# EAGLE design TOMO (EAGLE 6.4)
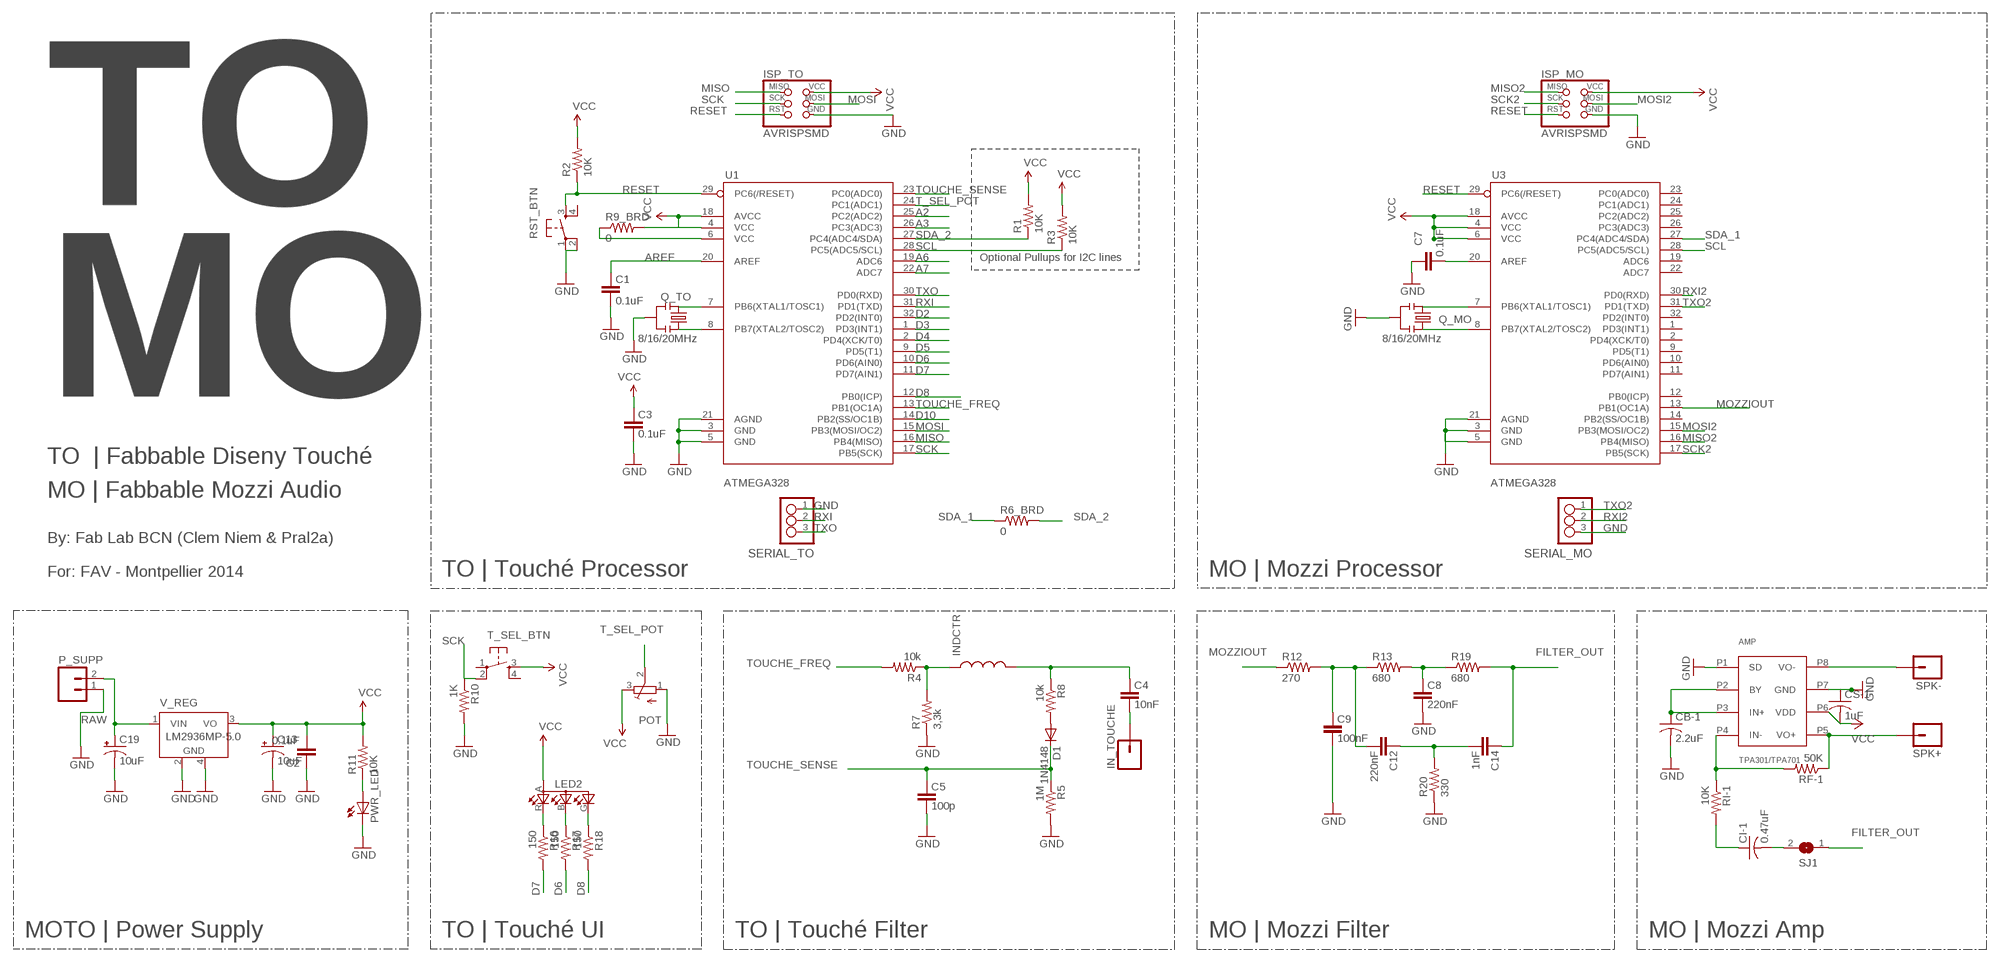
[diagram p0: schematic, sheet 1]

## Parts
AMP  TPA301/TPA701  [SOIC8]
C1  0.1uF  CAP1206  [1206]
C2  0.1uF  CAP1206  [1206]
C3  0.1uF  CAP1206  [1206]
C4  10nF  CAP1206  [1206]
C5  100p  CAP1206  [1206]
C7  0.1uF  CAP1206  [1206]
C8  220nF  CAP1206  [1206]
C9  100nF  CAP1206  [1206]
C12  220nF  CAP1206  [1206]
C13  10uF  CAP_POL1206  [EIA3216]
C14  1nF  CAP1206  [1206]
C19  10uF  CAP_POL1206  [EIA3216]
CB-1  2.2uF  C-USC1206  [C1206]
CI-1  0.47uF  C-USC1206  [C1206]
CS-1  1uF  C-USC1206  [C1206]
D1  1N4148  DIODESOD123  [SOD123]
IN_TOUCHE  M01PTH  [1X01]
INDCTR  INDUCTOR  [CDRH3D28]
ISP_MO  AVRISPSMD  [2X03SMD]
ISP_TO  AVRISPSMD  [2X03SMD]
LED2  LEDRGBOLD  [P-LCC-4-3]
P_SUPP  M02PTH  [1X02]
POT  TRIMPOTTC33X  [TC33X]
PWR_LED  LED1206  [1206]
Q_MO  8/16/20MHz  RESONATORSMD  [RESONATOR-SMD]
Q_TO  8/16/20MHz  RESONATORSMD  [RESONATOR-SMD]
R1  10K  RESISTOR1206  [1206]
R2  10K  RESISTOR1206  [1206]
R3  10K  RESISTOR1206  [1206]
R4  10k  RESISTOR1206  [1206]
R5  1M  RESISTOR1206  [1206]
R6_BRD  0  RESISTOR1206  [1206]
R7  3,3k  RESISTOR1206  [1206]
R8  10k  RESISTOR1206  [1206]
R9_BRD  0  RESISTOR1206  [1206]
R10  1K  RESISTOR1206  [1206]
R11  10K  RESISTOR1206  [1206]
R12  270  RESISTOR1206  [1206]
R13  680  RESISTOR1206  [1206]
R16  150  RESISTOR1206  [1206]
R17  150  RESISTOR1206  [1206]
R18  150  RESISTOR1206  [1206]
R19  680  RESISTOR1206  [1206]
R20  330  RESISTOR0603-RES  [0603-RES]
RF-1  50K  R-US_R1206  [R1206]
RI-1  10K  R-US_R1206  [R1206]
RST_BTN  6MM_SWITCH6MM_SWITCH  [6MM_SWITCH]
SERIAL_MO  3_PIN_HEADERHEADER  [SMT_PINS_3]
SERIAL_TO  3_PIN_HEADERHEADER  [SMT_PINS_3]
SJ1  SJW  [SJW]
SPK+  M01PTH  [1X01]
SPK-  M01PTH  [1X01]
T_SEL_BTN  6MM_SWITCH6MM_SWITCH  [6MM_SWITCH]
U1  ATMEGA328  ATMEGA168ATMEGA88THIN  [ATMEGA88THIN]
U3  ATMEGA328  ATMEGA168ATMEGA88THIN  [ATMEGA88THIN]
V_REG  LM2936MP-5.0  [SOT223]

## Nets
A2: U1.25(PC2(ADC2))
A3: U1.26(PC3(ADC3))
A6: U1.19(ADC6)
A7: U1.22(ADC7)
AREF: C1.2 U1.20(AREF)
D2: U1.32(PD2(INT0))
D3: U1.1(PD3(INT1))
D4: U1.2(PD4(XCK/T0))
D5: U1.9(PD5(T1))
D6: R17.2 U1.10(PD6(AIN0))
D7: R16.2 U1.11(PD7(AIN1))
D8: R18.2 U1.12(PB0(ICP))
D10: U1.14(PB2(SS/OC1B))
FILTER_OUT: C14.2 R19.2 SJ1.1
GND [gnd]: AMP.P1(SD) AMP.P7(GND) C1.1 C2.1 C3.1 C5.1 C7.2 C8.1 C9.1 C13.C(-) C19.C(-) CB-1.2 CS-1.1 ISP_MO.6(GND) ISP_TO.6(GND) P_SUPP.1 POT.1(A) PWR_LED.2(C) Q_MO.2 Q_TO.2 R5.2 R7.1 R10.2 R20.1 RST_BTN.1(P) RST_BTN.2(P1) SERIAL_MO.3 SERIAL_TO.1 U1.3(GND) U1.5(GND) U1.21(AGND) U3.3(GND) U3.5(GND) U3.21(AGND) V_REG.2(GND) V_REG.4(GND)
MISO: ISP_TO.1(MISO) U1.16(PB4(MISO))
MISO2: ISP_MO.1(MISO) U3.16(PB4(MISO))
MOSI: ISP_TO.4(MOSI) U1.15(PB3(MOSI/OC2))
MOSI2: ISP_MO.4(MOSI) U3.15(PB3(MOSI/OC2))
MOZZIOUT: R12.1 U3.13(PB1(OC1A))
N$1: Q_TO.1 U1.8(PB7(XTAL2/TOSC2))
N$1-: CI-1.2 SJ1.2
N$2: Q_TO.3 U1.7(PB6(XTAL1/TOSC1))
N$3: INDCTR.1 R4.1 R7.2
N$4: C4.2 INDCTR.2 R8.1
N$5: LED2.G(CGREEN) R18.1
N$7: D1.ANODE(A) R8.2
N$9: Q_MO.3 U3.7(PB6(XTAL1/TOSC1))
N$12: Q_MO.1 U3.8(PB7(XTAL2/TOSC2))
N$13: C12.2 C14.1 R20.2
N$14: C4.1 IN_TOUCHE.1
N$14-: CI-1.1 RI-1.2
N$15: LED2.R(CRED) R16.1
N$16: C7.1 U3.20(AREF)
N$18: C9.2 C12.1 R12.2 R13.1
N$20: LED2.B(CBLUE) R17.1
N$21 [gnd]: R9_BRD.1 U1.6(VCC)
N$21-: AMP.P4(IN-) RF-1.2 RI-1.1
N$22: C8.2 R13.2 R19.1
N$23-: AMP.P2(BY) AMP.P3(IN+) CB-1.1
N$38: PWR_LED.1(A) R11.1
RAW [gnd]: C19.A(+) P_SUPP.2 V_REG.1(VIN)
RESET: ISP_MO.5(RST) ISP_TO.5(RST) R2.1 RST_BTN.3(S) U1.29(PC6(/RESET)) U3.29(PC6(/RESET))
RXI: SERIAL_TO.2 U1.31(PD1(TXD))
RXI2: SERIAL_MO.2 U3.30(PD0(RXD))
SCK: ISP_TO.3(SCK) R10.1 T_SEL_BTN.2(P1) U1.17(PB5(SCK))
SCK2: ISP_MO.3(SCK) U3.17(PB5(SCK))
SCL: R3.1 U1.28(PC5(ADC5/SCL)) U3.28(PC5(ADC5/SCL))
SDA_1: R6_BRD.1 U3.27(PC4(ADC4/SDA))
SDA_2: R1.1 R6_BRD.2 U1.27(PC4(ADC4/SDA))
SPK_L+: AMP.P5(VO+) RF-1.1 SPK+.1
SPK_L-: AMP.P8(VO-) SPK-.1
T_SEL_POT: POT.2(S) U1.24(PC1(ADC1))
TOUCHE_FREQ: R4.2 U1.13(PB1(OC1A))
TOUCHE_SENSE: C5.2 D1.CATHODE(C) R5.1 U1.23(PC0(ADC0))
TXO: SERIAL_TO.3 U1.30(PD0(RXD))
TXO2: SERIAL_MO.1 U3.31(PD1(TXD))
VCC [gnd]: AMP.P6(VDD) C2.2 C3.2 C13.A(+) CS-1.2 ISP_MO.2(VCC) ISP_TO.2(VCC) LED2.A(A2) POT.3(E) R1.2 R2.2 R3.2 R9_BRD.2 R11.2 T_SEL_BTN.3(S) U1.4(VCC) U1.18(AVCC) U3.4(VCC) U3.6(VCC) U3.18(AVCC) V_REG.3(VO)
Unconnected: RST_BTN.4(S1) T_SEL_BTN.1(P) T_SEL_BTN.4(S1) U3.1(PD3(INT1)) U3.2(PD4(XCK/T0)) U3.9(PD5(T1)) U3.10(PD6(AIN0)) U3.11(PD7(AIN1)) U3.12(PB0(ICP)) U3.14(PB2(SS/OC1B)) U3.19(ADC6) U3.22(ADC7) U3.23(PC0(ADC0)) U3.24(PC1(ADC1)) U3.25(PC2(ADC2)) U3.26(PC3(ADC3)) U3.32(PD2(INT0))

## Notes on the sheet
- TO
- Optional Pullups for I2C lines
- MO
- TO  | Fabbable Diseny Touché
- MO | Fabbable Mozzi Audio
- By: Fab Lab BCN (Clem Niem & Pral2a)
- For: FAV - Montpellier 2014 | TO | Touché Processor | MO | Mozzi Processor
- MOTO | Power Supply | TO | Touché UI | TO | Touché Filter | MO | Mozzi Filter | MO | Mozzi Amp

## Library data of the parts
AMP = mellis:TPA301/TPA701
C1-C5 C7-C9 C12 C14 = 01_SparkFun:CAP: Capacitor Standard 0603 ceramic capacitor, and 0.1" leaded capacitor.
C13 C19 = SparkFun:CAP_POL: Capacitor Polarized These are standard SMD and PTH capacitors. Normally 10uF, 47uF, and 100uF in electrolytic and tantalum varieties. Always verify the external diameter of the through hole cap, it varies with capacity, voltage, and manufacturer. The EIA devices should be standard.
CB-1 CI-1 CS-1 = rcl:C-US: CAPACITOR, American symbol
D1 = 01_fab:DIODE: DIODE high speed (Philips)
IN_TOUCHE SPK+ SPK- = SparkFun:M01: Header 1 Standard 1-pin 0.1" header. Use with straight break away headers (SKU : PRT-00116), right angle break away headers (PRT-00553), swiss pins (PRT-00743), machine pins (PRT-00117), and female headers (PRT-00115).
INDCTR = 01_SparkFun:INDUCTOR: Inductors Basic Inductor/Choke - 0603 and 1206. Footprints are not proven and vary greatly between part numbers.
ISP_MO ISP_TO = fab:AVRISP
LED2 = 01_fab:LEDRGBOLD: OSRAM Hyper Multi TOPLED® Hyper-Bright LED LATB T686 Source: http://www.osram.convergy.de/
P_SUPP = 01_SparkFun:M02: Header 2 Standard 2-pin 0.1" header. Use with straight break away headers (SKU : PRT-00116), right angle break away headers (PRT-00553), swiss pins (PRT-00743), machine pins (PRT-00117), and female headers (PRT-00115). Molex polarized connector foot print use with SKU : PRT-08233 with associated crimp pins and housings.
POT = 01_adafruit:TRIMPOT: SMT trimmer potentiometer part number TC33X http://www.ladyada.net/library/eagle
PWR_LED = FAB_Hello:LED
Q_MO Q_TO = SparkFun:RESONATOR: Resonator Small SMD resonator. This is the itty bitty 10/20MHz resonators with built in caps. CSTCE10M0G55 and CSTCE20M0V53. Footprint has been reviewed closely but hasn't been tested yet.
R1-R5 R6_BRD R7 R8 R9_BRD R10-R13 R16-R19 = 01_FAB_Hello:RESISTOR
R20 = 01_SparkFun:RESISTOR: Resistor Basic schematic elements and footprints for 0603, 1206, and PTH 1/10th watt (small) resistors.
RF-1 RI-1 = rcl:R-US_: RESISTOR, American symbol
RST_BTN T_SEL_BTN = fab:6MM_SWITCH: OMRON SWITCH
SERIAL_MO SERIAL_TO = ng:3_PIN_HEADER: 3 SMT pin pads
SJ1 = jumper:SJ: SMD solder JUMPER
U1 U3 = SparkFun:ATMEGA168
V_REG = national-semiconductor:LM2936MP?*: Ultra-Low Quiescent Current LDO Voltage Regulator Source: Data sheet <http://www.national.com/ds/LM/LM2936.pdf>; MF: NATIONAL SEMICONDUCTOR; MPN: LM2936MP-5.0/NOPB; OC_FARNELL: 1469063; OC_NEWARK: 41K4524

## Net classes
0 default: width 0.406 mm, drill 0.508 mm, clearance 0.381 mm
1 gnd: width 0.406 mm, drill 0.508 mm, clearance 0.381 mm

## Board
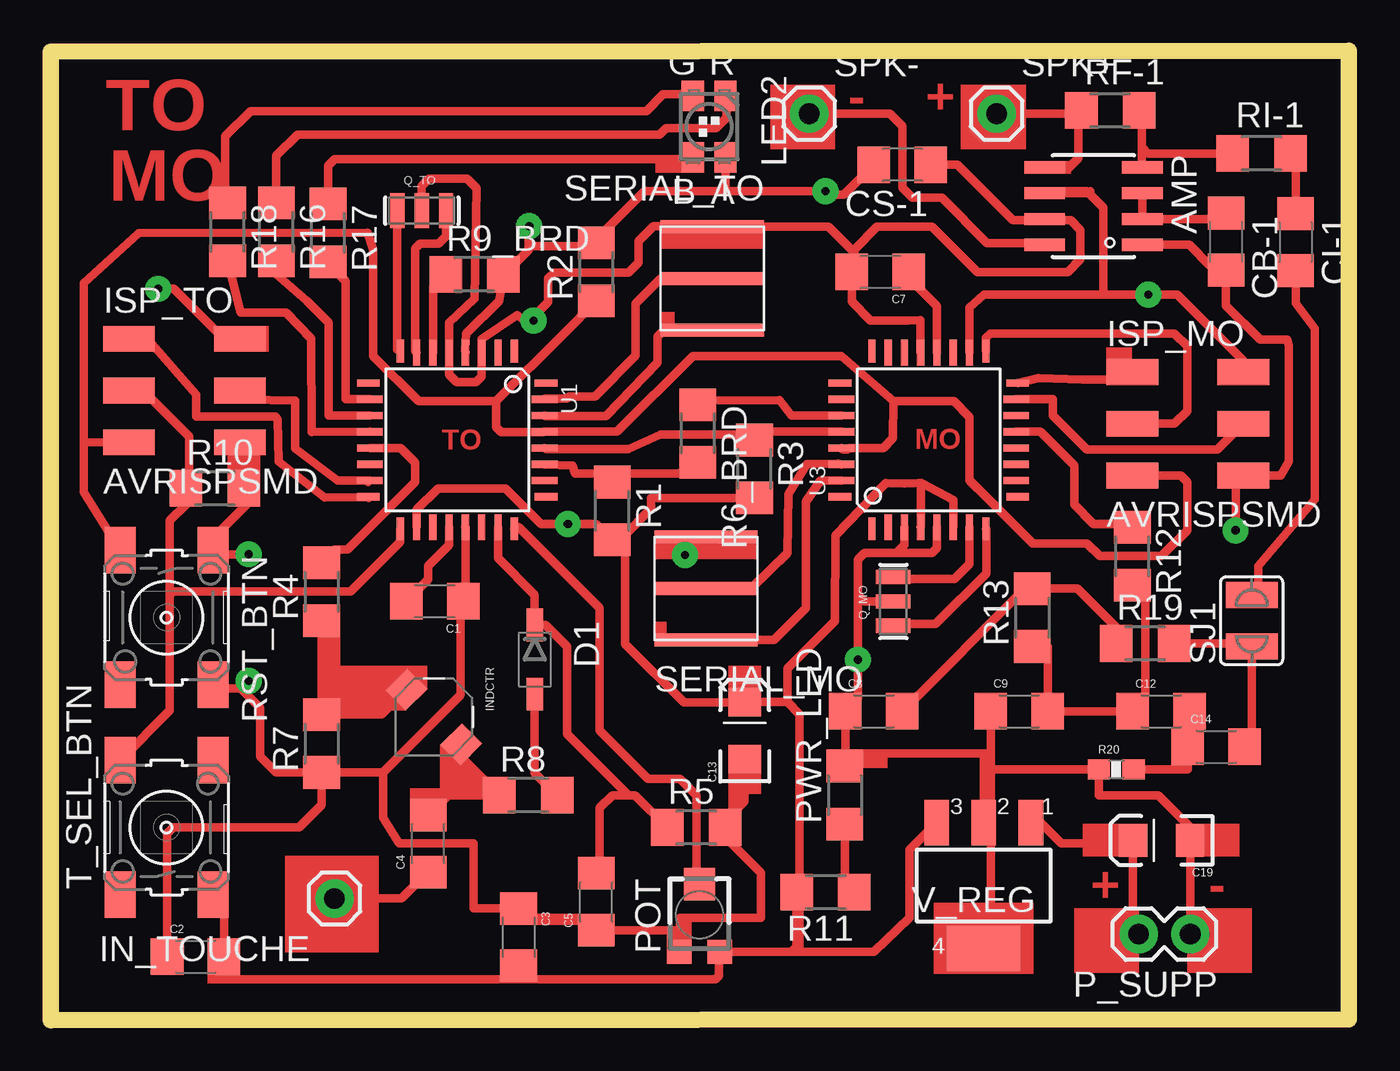
[diagram p1: board, top side]
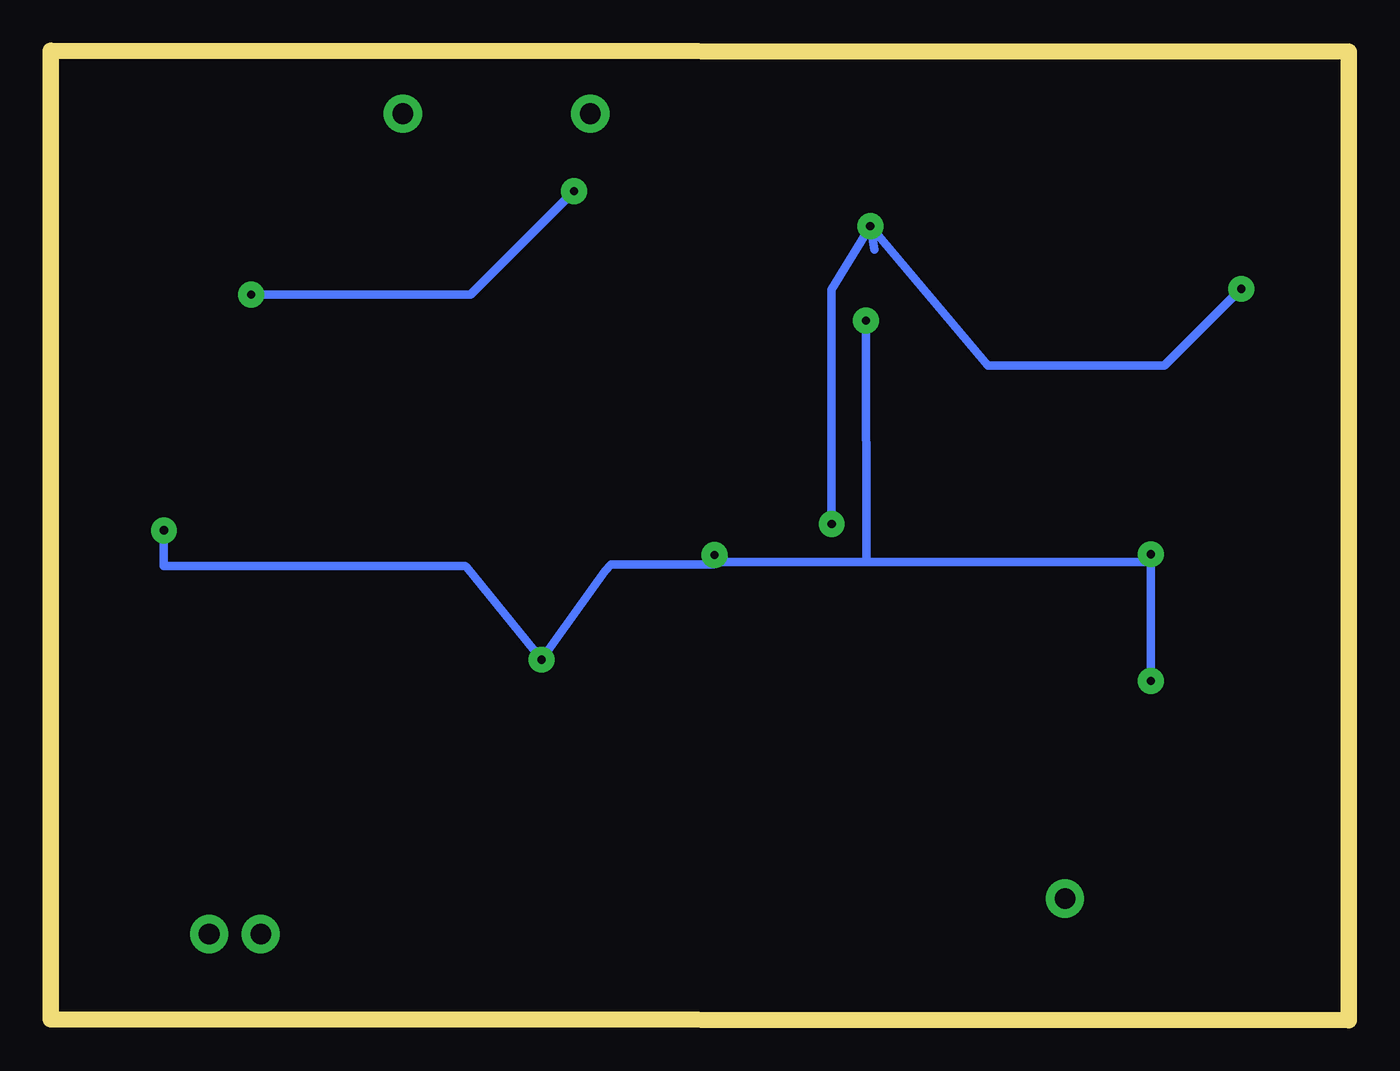
[diagram p2: board, bottom side, seen from below]

Size 63.79 x 47.65 mm. Coordinates in mm from the lower left corner, seen from the top.
Outline: 0,0 63.78,0.04 63.79,47.65 0,47.61 0,0
Copper layers (1*16): Top 0.035mm / dielectric 1.5mm / Bottom 0.035mm
Design rules "default *": minimum track width 10mil, minimum drill 24mil, track to track 16mil, track to pad 16mil, pad to pad 16mil, via to via 16mil, smd to smd 8mil, copper to edge 40mil, drill to drill 8mil, minimum pad ring 10mil, minimum via ring 8mil, stop-mask expansion 4mil, vias tented up to drill 0mil, thermal gap 10mil

### Footprints (pad centres in the part's own frame; a part is rotated, then mirrored left to right if it is on the bottom)
SOIC8 = smd 0.6 x 2: P1 1.905,2.4; P2 0.635,2.4; P3 -0.635,2.4; P4 -1.905,2.4; P5 -1.905,-2.4; P6 -0.635,-2.4; P7 0.635,-2.4; P8 1.905,-2.4
1206 = smd 1.6 x 1.8: 1 -1.4,0; 2 1.4,0
EIA3216 = smd 1.4 x 1.6: A 1.4,0; C -1.4,0
C1206 = smd 1.6 x 1.8: 1 -1.4,0; 2 1.4,0
SOD123 = smd 1.6 x 0.8: ANODE 1.7,0; CATHODE -1.7,0
1X01 = drill 1.016 pad 1.88: 1 0,0
CDRH3D28 = smd 1.5 x 1.4 rotated 315: 1 -1.374,-1.384; 2 1.312,1.302
2X03SMD = smd 2.54 x 1.27: 1 -2.54,2.54; 2 2.92,2.54; 3 -2.54,0; 4 2.92,0; 5 -2.54,-2.54; 6 2.92,-2.54
P-LCC-4-3 = smd 1.1 x 1.5: A -0.8,1.5; B 0.8,1.5; G 0.8,-1.5; R -0.8,-1.5
1X02 = drill 1.016 pad 1.88: 1 0,0; 2 2.54,0
TC33X = smd 1.2 x 1.2: 1 -1,-1.825; 3 1,-1.825 | smd 1.5 x 1.6: 2 0,1.5
1206' = smd 1.6 x 1.803: 1 -1.422,0; 2 1.422,0
RESONATOR-SMD = smd 0.7 x 1.7: 1 -1.2,0; 2 0,0; 3 1.2,0
0603-RES = smd 1.1 x 1: 1 -0.85,0; 2 0.85,0
R1206 = smd 1.6 x 1.803: 1 -1.422,0; 2 1.422,0
6MM_SWITCH = smd 2.286 x 1.524: 1 -3.302,2.286; 2 3.302,2.286; 3 -3.302,-2.286; 4 3.302,-2.286
SMT_PINS_3 = smd 5.08 x 0.635: 1 0,0; 2 0,2.54; 3 0,5.08
SJW = smd 1.27 x 2.54: 1 -1.27,0; 2 1.27,0
ATMEGA88THIN = smd 1.118 x 0.356: 1 -4.369,2.8; 8 -4.369,-2.8; 17 4.369,-2.8; 24 4.369,2.8 | smd 1.27 x 0.356: 2 -4.293,2; 3 -4.293,1.2; 4 -4.293,0.4; 5 -4.293,-0.4; 6 -4.293,-1.2; 7 -4.293,-2; 18 4.293,-2; 19 4.293,-1.2; 20 4.293,-0.4; 21 4.293,0.4; 22 4.293,1.2; 23 4.293,2 | smd 0.356 x 1.118: 9 -2.8,-4.369; 16 2.8,-4.369; 25 2.8,4.369; 32 -2.8,4.369 | smd 0.356 x 1.27: 10 -2,-4.293; 14 1.2,-4.293; 15 2,-4.293; 26 2,4.293; 27 1.2,4.293; 31 -2,4.293 | smd 0.35 x 1.27: 11 -1.2,-4.293; 12 -0.4,-4.293; 13 0.4,-4.293; 28 0.4,4.293; 29 -0.4,4.293; 30 -1.2,4.293
SOT223 = smd 1.219 x 2.235: 1 -2.311,-3.099; 2 0,-3.099; 3 2.311,-3.099 | smd 3.6 x 2.2: 4 0,3.099

### Placement (x,y rotation side)
AMP  51.25,40.01 270 top
C1  18.86,20.58 180 top
C2  7.12,3.12 0 top
C3  22.99,4.07 270 top
C4  18.55,8.68 90 top
C5  26.8,5.82 90 top
C7  40.77,36.77 180 top
C8  40.45,15.18 0 top
C9  47.6,15.18 0 top
C12  54.58,15.18 0 top
C13  34.1,14.23 90 top
C14  57.28,13.44 0 top
C19  54.58,8.83 180 top
CB-1  57.76,38.27 270 top
CI-1  61.19,38.24 270 top
CS-1  41.85,42.05 180 top
D1  23.79,17.72 270 top
IN_TOUCHE  13.94,5.98 180 top
INDCTR  18.86,14.87 270 top
ISP_MO  55.69,29.31 0 top
ISP_TO  6.38,30.95 0 top
LED2  32.36,43.92 180 top
P_SUPP  56.01,4.23 180 top
POT  31.88,5.18 0 top
PWR_LED  [1206']  39.03,11.06 90 top
Q_MO  41.41,20.58 90 top
Q_TO  18.23,39.79 0 top
R1  10K  [1206']  27.6,25.03 270 top
R2  10K  [1206']  26.8,36.77 90 top
R3  10K  [1206']  34.58,27.09 270 top
R4  10k  [1206']  13.31,21.06 90 top
R5  1M  [1206']  31.72,9.47 0 top
R6_BRD  0  [1206']  31.8,28.83 270 top
R7  3,3k  [1206']  13.31,13.6 90 top
R8  10k  [1206']  23.47,11.06 0 top
R9_BRD  0  [1206']  20.83,36.66 0 top
R10  1K  [1206']  8.07,26.14 0 top
R11  10K  [1206']  38.07,6.29 180 top
R12  270  [1206']  53.15,22.8 270 top
R13  680  [1206']  48.23,19.79 90 top
R16  150  [1206']  11.09,38.74 270 top
R17  150  [1206']  13.63,38.69 270 top
R18  150  [1206']  8.69,38.74 270 top
R19  680  [1206']  53.79,18.52 0 top
R20  52.36,12.33 0 top
RF-1  52.07,44.71 0 top
RI-1  59.51,42.6 0 top
RST_BTN  5.69,19.79 270 top
SERIAL_MO  32.2,18.68 0 top
SERIAL_TO  32.52,39 180 top
SJ1  59.03,19.63 90 top
SPK+  46.49,44.55 0 top
SPK-  37.28,44.55 0 top
T_SEL_BTN  5.69,9.47 90 top
U1  19.98,28.52 270 top
U3  43.15,28.52 90 top
V_REG  45.85,6.61 180 top

### Tracks (layer width: path | path; a pad name or v marks a point on that pad's centre or on a via)
AREF
  Top 0.406: U1.20 19.58,23.36 18.55,22.33 18.55,21.67 C1.2
D6
  Top 0.406: U1.10 14.48,30.53 14.48,36.32 13.63,37.18 R17.2
D7
  Top 0.406: R16.2 11.09,36.66 12.59,35.34 13.64,34.29 13.64,29.72 U1.11
D8
  Top 0.406: R18.2 9.34,34.78 11.58,34.78 12.8,33.5 12.81,28.9 U1.12
FILTER_OUT
  Top 0.406: R19.2 58.87,18.52 SJ1.1 59.03,13.31 C14.2
GND  (via drill 0.41 pad 1.27)
  Top 0.406: R7.1 16.33,12.18 | 16.33,12.18 20.13,15.98 20.13,21.22 20.29,21.38 | 20.29,21.38 20.29,20.61 C1.1 | C9.1 46.2,13.12 | 16.33,12.18 16.32,12.17 16.32,9.95 17.12,8.68 20.77,8.68 20.77,5.5 22.96,5.5 C3.1 23.18,5.47 23.74,4.91 26.16,4.91 26.25,5 | 33.31,8.84 33.15,8.99 R5.2 33.14,9.78 33.31,9.95 | 30.93,4.39 30.93,5.03 34.9,5.03 34.9,7.25 33.31,8.84 | 30.93,4.39 30.93,3.41 POT.1 | U3.3 41.95,23.35 41.57,22.96 | 41.57,22.96 39.98,22.96 39.66,22.65 39.66,22.39 | 39.66,22.39 39.66,20.9 | Q_MO.2 39.98,20.58 39.66,20.9 | 39.66,20.9 39.66,15.79 C8.1 39.05,13.12 | U3.5 43.55,23.21 43.31,22.96 41.57,22.96 | R7.1 13.31,10.58 12.2,9.47 6.01,9.47 5.72,9.18 C2.1 5.69,2.96 | 53.59,38.05 AMP.P1 55.95,38.11 56.96,37.09 57.53,37.09 CB-1.2 57.76,35.12 59.44,33.44 60.77,33.44 60.85,33.16 60.85,27.45 60.46,26.77 ISP_MO.6 58.23,26.77 v58.23,24.08 | 39.5,37.73 39.5,37.89 40.61,39 43.31,39 45.53,36.78 49.98,36.78 50.61,37.41 50.61,38.84 50.14,39.32 48.91,39.32 AMP.P7 48.79,39.32 47.28,39.32 44.55,42.05 CS-1.1 | 39.5,37.73 39.5,36.91 C7.2 39.37,35.32 40.3,34.39 42.12,34.39 42.73,34.41 42.73,32.84 U3.21 | ISP_TO.6 9.1,28.34 R10.2 9.72,25.43 7.97,23.69 RST_BTN.1 8.07,22.9 v9.72,22.9 | 39.05,13.12 39.05,12.93 PWR_LED.2 | C13.C 34.1,10.74 33.31,9.95 | 33.31,9.95 33.31,8.84 | R7.1 11.08,12.18 10.29,12.96 10.29,15.34 9.34,16.3 | 39.5,37.73 38.23,39 SERIAL_TO.1 30.68,39 | 30.14,39 30.68,39 | 9.34,16.3 8.16,16.3 RST_BTN.2 | 9.34,16.3 v9.72,16.68 | v31.17,22.86 32.2,23.66 SERIAL_MO.3 | 30.93,4.39 30.9,4.42 C5.1 26.8,4.45 26.25,5 | 46.2,13.12 46.01,13.12 | 46.01,13.12 39.05,13.12 | v39.67,17.72 39.66,22.39
  Top 0.406: 46.2,13.12 46.2,12.33 | 46.2,12.33 46.2,3.86 V_REG.4 | V_REG.2 45.85,12.96 46.01,13.12 | R20.1 51.51,12.07 51.67,12.07 | P_SUPP.1 56.01,8.39 C19.C 56.14,9.34 54.42,11.06 51.51,11.06 R20.1 | 46.2,12.33 R20.1 | 30.68,39 30.64,39.03 29.62,39.03 28.88,38.29 28.88,37.24 28.4,36.75 24.74,36.75 24.45,36.46 24.45,35.29 23.63,34.46 23.63,34.39 23.69,34.2 v23.73,34.39 23.52,34.25 22.91,34.64 21.16,33.47 U1.3 21.18,31.64 20.9,31.37 19.95,31.37 19.58,31.74 U1.5 19.58,34.3 20.82,35.47 20.93,40.9 20.47,41.36 18.6,41.36 18.23,40.99 Q_TO.2 | U1.21 20.38,21.46 20.29,21.38 | 26.25,5
  Bottom 0.406: v9.72,16.68 v9.72,22.9 9.85,22.52 23.71,22.52 | 23.71,22.52 31.15,22.51 31.17,22.53 v31.17,22.86 31.18,22.39 36.24,22.39 36.55,22.08 v39.67,17.72 43.36,22.27 43.42,22.33 58.23,22.33 v58.23,24.08 | 23.71,22.52 v23.73,34.39
MISO
  Top 0.406: 15.63,25.66 U1.16 13.45,25.69 11.2,27.45 11.16,29.52 11.05,29.66 7.14,29.66 7.14,30.75 4.78,33.44 ISP_TO.1
MISO2
  Top 0.406: U3.16 48.55,31.57 50.69,31.49 52.97,31.49 ISP_MO.1
MOSI
  Top 0.406: 15.59,26.46 U1.15 14.09,26.52 12.02,28.11 12,30.46 9.56,30.51 ISP_TO.4
MOSI2
  Top 0.406: U3.15 49.25,30.52 49.25,29.73 50.93,28.04 57.34,28.04 ISP_MO.4
MOZZIOUT
  Top 0.406: U3.13 48.63,28.92 50.3,27.25 50.3,25.35 51.25,24.39 52.99,24.39 R12.1
N$1
  Top 0.406: Q_TO.1 17.03,32.96 U1.8
N$1-
  Top 0.406: CI-1.2 61.19,35.25 62.11,34 62.11,25.59 59.35,22.33 59.35,21.22 SJ1.2
N$2
  Top 0.406: Q_TO.3 19.43,38.54 19.05,38.17 18.14,38.17 17.91,37.93 17.91,37.57 17.91,32.88 U1.7
N$3
  Top 0.406: R4.1 R7.2 16.26,15.02 INDCTR.1
N$4
  Top 0.406: INDCTR.2 20.17,12.94 R8.1 19.53,11.06 C4.2
N$5
  Top 0.406: LED2.G 30.99,45.51 30.1,45.51 29.28,44.69 9.82,44.69 8.58,43.44 8.58,39.66 R18.1
N$7
  Top 0.406: D1.ANODE 23.79,12.16 R8.2
N$9
  Top 0.406: U3.7 45.15,22.42 44.42,21.69 41.5,21.69 Q_MO.3
N$12
  Top 0.406: Q_MO.1 41.5,19.47 43.47,19.47 45.99,21.94 45.98,24.13 U3.8
N$13
  Top 0.406: C12.2 C14.1 55.88,12.33 R20.2
N$14
  Top 0.406: IN_TOUCHE.1 17.25,5.98 C4.1
N$14-
  Top 0.406: CI-1.1 61.19,42.35 RI-1.2
N$15
  Top 0.406: 11.09,40.7 11.02,40.05 11.11,40.53 R16.1 11.09,40.7 | 11.09,40.7 11.09,42.49 12.12,43.53 29.91,43.53 30.23,43.84 32.69,43.84 33.22,44.37 33.22,45.36 LED2.R
N$16
  Top 0.406: U3.20 43.55,35.11 42.52,36.14 42.52,36.42 C7.1
N$17
  cutout Top: 51.39,4.53 arc-90 51.61,4.31 51.61,3.31 arc-90 51.6,3.3 50.83,3.3 arc90 51.28,3.74 51.28,4.56 arc-90 51.43,4.4 51.43,4.37
N$18
  Top 0.406: R12.2 53.15,21.22 53.79,20.58 53.79,15.95 C12.1 C9.2 49,18.37 R13.1
N$20
  Top 0.406: R17.1 13.63,42.01 13.94,42.33 30.99,42.33 LED2.B
N$21
  Top 0.406: U1.6 18.78,36.04 R9_BRD.1
N$21-
  Top 0.406: RF-1.2 53.01,44.23 53.48,44.23 53.63,44.08 53.63,42.93 | 53.63,42.93 53.63,41.94 AMP.P4 | RI-1.1 53.95,42.6 53.63,42.93
N$22
  Top 0.406: R19.1 52.37,19.31 50.46,21.22 R13.2 47.88,21.21 C8.2
N$23-
  Top 0.406: AMP.P3 AMP.P2 57.47,39.38 CB-1.1
N$38
  Top 0.406: PWR_LED.1 39.03,6.76 R11.1
RAW
  Top 0.406: V_REG.1 48.63,9.71 49.66,8.68 53.18,8.68 C19.A 53.18,4.52 P_SUPP.2
RESET
  Top 0.406: 41.41,30.43 41.4,28.62 40.91,28.11 39.22,28.11 39.15,28.04 38.94,28.04 U3.29 | 52.36,26.77 ISP_MO.5 55.54,26.77 55.85,26.46 55.85,24.08 54.58,22.81 51.57,22.81 50.93,23.44 48.23,23.44 48.23,23.45 45.16,26.52 | 21.88,30.43 25.21,33.76 R2.1 | 21.88,30.43 21.88,29.16 22.14,28.92 24.2,28.92 U1.29 27.84,28.92 31.56,32.65 38.87,32.65 41.41,30.43 | 21.88,30.43 18.07,30.43 15.85,32.65 15.85,37.89 15.58,38.72 4.31,38.69 1.62,36.24 1.62,28.51 | RST_BTN.3 1.62,25.95 1.62,28.51 | ISP_TO.5 1.74,28.4 1.62,28.51 | 45.56,26.14 45.53,26.14 45.16,26.51 45.16,26.52 | 41.41,30.43 41.41,30.42 44.38,30.42 45.15,29.65 45.15,26.52 45.16,26.52
RXI
  Top 0.406: SERIAL_TO.2 32.04,36.46 | SERIAL_TO.2 29.98,36.46 28.75,35.23 28.75,32.67 26.74,30.66 25.48,30.66 25.37,30.55 24.3,30.55 U1.31 | SERIAL_TO.2 32.03,36.46 31.92,36.57
RXI2
  Top 0.406: U3.30 38.69,27.35 37.15,27.32 36.25,25.86 36.2,22.97 34.42,21.22 SERIAL_MO.2
SCK
  Top 0.406: ISP_TO.3 4.58,30.9 6.8,28.68 6.8,25.81 R10.1 6.65,25.35 5.85,24.55 5.85,20.9 | 5.85,20.9 5.85,15.22 T_SEL_BTN.2 | U1.17 17.18,23.5 14.74,21.06 6.01,21.06 5.85,20.9
SCK2
  Top 0.406: ISP_MO.3 55.22,29.31 55.85,29.95 55.85,33.12 55.22,33.76 46.17,33.76 45.95,33.54 U3.17
SCL
  Top 0.406: U3.28 34.99,28.92 R3.1 34.14,28.79 29.96,28.79 28.39,28.08 24.35,28.08 U1.28
SDA_1
  Top 0.406: U3.27 36.41,29.71 35.8,30.49 31.76,30.45 R6_BRD.1
SDA_2
  Top 0.406: U1.27 25.64,27.26 25.75,26.87 27.3,26.87 | 27.3,26.87 30.86,26.87 R6_BRD.2 | R1.1 27.6,26.57 27.3,26.87
SPK_L+
  Top 0.406: SPK+.1 50.49,44.55 | 50.49,44.55 RF-1.1 | 50.49,44.55 50.49,42.37 49.98,41.86 48.91,41.86 AMP.P5
SPK_L-
  Top 0.406: SPK-.1 41.25,44.55 41.86,43.93 41.86,40.91 42.36,40.43 43.79,40.43 46.01,38.2 48.75,38.2 AMP.P8
T_SEL_POT
  Top 0.406: U1.24 23,24.23 26.96,20.27 26.96,14.23 29.34,11.85 30.93,11.85 31.72,11.06 31.72,6.84 POT.2
TOUCHE_FREQ
  Top 0.406: U1.13 17.2,28.12 17.91,27.41 17.91,26.46 14.58,23.12 13.95,23.12 R4.2
TOUCHE_SENSE
  Top 0.406: U1.23 21.98,22.71 23.79,20.9 D1.CATHODE 24.31,19.43 25.37,18.36 25.37,14.07 28.39,11.06 | 28.39,11.06 28.71,11.06 R5.1 | 28.39,11.06 27.6,11.06 26.96,10.42 26.96,6.77 26.8,6.61 C5.2
TXO
  Top 0.406: SERIAL_TO.3 30.14,33.92 29.82,33.6 29.82,32.33 27.28,29.71 24.34,29.71 U1.30
TXO2
  Top 0.406: U3.31 37.82,26.52 37.12,25.5 37.12,20.27 35.53,18.68 SERIAL_MO.1
VCC  (via drill 0.41 pad 1.27)
  Top 0.406: R1.2 27.6,23.6 28.23,22.96 28.23,18.5 | ISP_MO.2 58.61,32.43 55.38,35.66 v53.95,35.66 51.57,35.66 | U3.6 44.35,25.57 42.8,26.4 42.64,26.4 | 42.64,26.4 41.95,26.38 41.04,26.4 38.56,23.81 38.55,19.63 36.49,17.57 36.49,17.56 36.35,17.43 36.21,17.29 36.21,15.64 36.2,15.63 | U3.4 42.76,24.28 42.76,26.27 42.64,26.4 | R3.2 29.51,25.67 29.51,25.14 28.12,23.76 27.75,23.76 R1.2 | 51.57,35.66 45.85,35.66 45.15,35.03 45.15,32.88 U3.18 | U1.18 17.98,25.09 19.02,26.14 22.36,26.14 24.1,24.39 v25.41,24.39 | v25.41,24.39 26.81,24.39 R1.2 | 23.49,37.85 23.61,38.04 26.64,38.04 R2.2 26.48,38.04 29.18,40.74 32.99,40.74 | 23.49,37.85 R9_BRD.2 22.03,35.35 20.4,33.76 20.37,32.95 U1.4 | 8.83,2.8 C2.2 | C2.2 8.52,5.28 T_SEL_BTN.3 | 50.93,40.74 48.94,40.74 AMP.P6 | AMP.P6 50.99,40.65 51.09,40.74 | 36.2,15.63 C13.A 34.08,15.61 31.12,15.61 28.23,18.5 | 36.8,6.3 36.8,15.03 36.2,15.63 | 36.8,6.3 R11.2 36.64,3.6 | AMP.P6 51.03,40.65 51.73,39.95 51.73,35.82 51.57,35.66 | 23.79,2.01 32.68,2.01 32.83,2.17 32.83,3.31 POT.3 36.41,3.36 36.64,3.6 | 23.79,2.01 23.66,2.01 | 23.66,2.01 C3.2 23.12,2.8 23.12,2.67 23.79,2.01 | 23.66,2.01 8.7,2.01 8.39,2.33 8.39,2.99 C2.2 | 32.99,40.74 33.15,40.74 | 33.16,40.75 33.15,40.74 | 10.48,33.44 ISP_TO.2 8.55,33.44 6.04,35.95 v5.27,35.95 | v23.51,39.03 23.49,37.85 | 48.71,40.59 AMP.P6 | 33.15,40.74 v38.07,40.74 38.23,40.59 38.99,40.59 CS-1.2 | LED2.A 33.16,40.91 32.99,40.74 | 36.8,6.3 36.8,3.76 | 36.8,3.76 36.64,3.6 | 36.8,3.76 36.8,3.6 36.5,3.37 40.46,3.37 42.2,5.03 42.2,8.37 V_REG.3 | v25.41,24.39 | 28.23,18.5 28.24,18.5
  Bottom 0.406: v23.51,39.03 23.31,37.89 | v38.07,40.74 43.15,35.66 v53.95,35.66 | v23.51,39.03 17.72,32.17 9.05,32.17 v5.27,35.95 | v25.41,24.39 25.41,35.91 v23.51,39.03
(copper drawn outside any net)
  shapes: Top area x36

### Text on the board
Top: - | + | TO | MO | TO | MO | + | -